# EAGLE design ESP32Driver (EAGLE 9.6.2)

## Sheet 1 of 4: ESP32
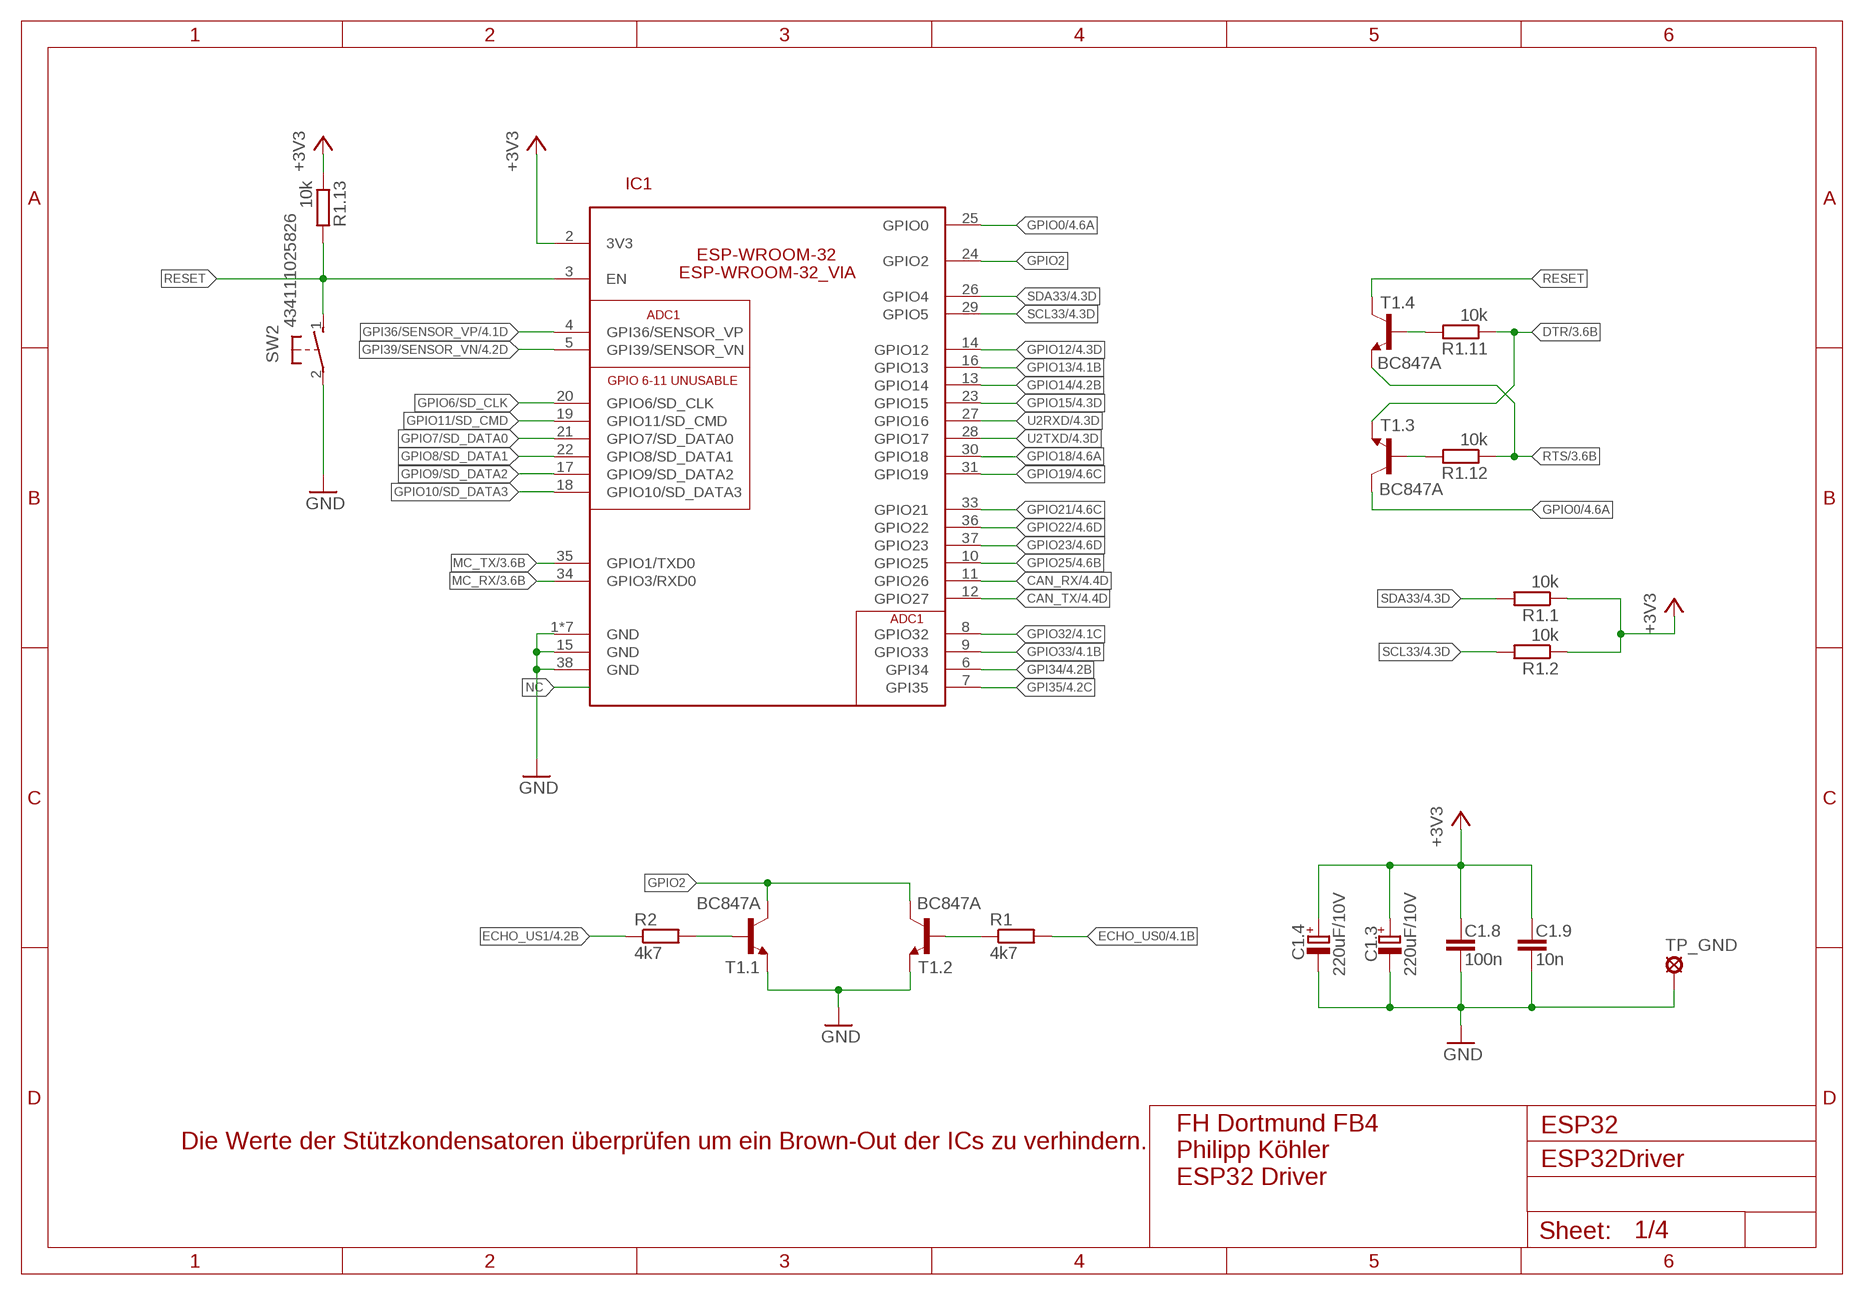
[diagram p0: schematic, sheet 1]

### Parts
C1.3  220uF/10V  CPOL-EUSMCC  [SMC_C]
C1.4  220uF/10V  CPOL-EUSMCC  [SMC_C]
C1.8  100n  C-EUC0805  [C0805]
C1.9  10n  C-EUC0805  [C0805]
IC1  ESP-WROOM-32_VIA  [ESP-WROOM-32-VIA]
R1  4k7  R-EU_R0603  [R0603]
R1.1  10k  R-EU_R0805  [R0805]
R1.2  10k  R-EU_R0805  [R0805]
R1.11  10k  R-EU_R0805  [R0805]
R1.12  10k  R-EU_R0805  [R0805]
R1.13  10k  R-EU_R0805  [R0805]
R2  4k7  R-EU_R0603  [R0603]
SW2  434111025826  [434121025816]
T1.1  BC847A  BC847ALT1SMD  [SOT23]
T1.2  BC847A  BC847ALT1SMD  [SOT23]
T1.3  BC847A  BC847ALT1SMD  [SOT23]
T1.4  BC847A  BC847ALT1SMD  [SOT23]
TP_GND  GND  LSP10  [LSP10]

### Nets
+3V3: C1.3.+ C1.4.+ C1.8.1 C1.9.1 IC1.2(3V3) R1.1.1 R1.2.1 R1.13.1 ; also sheet 2,3,4
CAN_RX: IC1.11(GPIO26) ; also sheet 4
CAN_TX: IC1.12(GPIO27) ; also sheet 4
DTR: R1.11.1 T1.3.2(E) ; also sheet 3
ECHO_US0: R1.2 ; also sheet 4
ECHO_US1: R2.1 ; also sheet 4
GND: C1.3.- C1.4.- C1.8.2 C1.9.2 IC1.1(GND) IC1.15(GND) IC1.38(GND) IC1.T_VIA1(GND) IC1.T_VIA2(GND) IC1.T_VIA3(GND) IC1.T_VIA4(GND) IC1.THERMAL1(GND) IC1.THERMAL(GND) SW2.2 T1.1.2(E) T1.2.2(E) TP_GND.MP ; also sheet 2,3,4
GPI34: IC1.6(GPI34) ; also sheet 4
GPI35: IC1.7(GPI35) ; also sheet 4
GPI36/SENSOR_VP: IC1.4(GPI36/SENSOR_VP) ; also sheet 4
GPI39/SENSOR_VN: IC1.5(GPI39/SENSOR_VN) ; also sheet 4
GPIO0: IC1.25(GPIO0) T1.3.3(C) ; also sheet 4
GPIO2: IC1.24(GPIO2) T1.1.3(C) T1.2.3(C)
GPIO6/SD_CLK: IC1.20(GPIO6/SD_CLK)
GPIO7/SD_DATA0: IC1.21(GPIO7/SD_DATA0)
GPIO8/SD_DATA1: IC1.22(GPIO8/SD_DATA1)
GPIO9/SD_DATA2: IC1.17(GPIO9/SD_DATA2)
GPIO10/SD_DATA3: IC1.18(GPIO10/SD_DATA3)
GPIO11/SD_CMD: IC1.19(GPIO11/SD_CMD)
GPIO12: IC1.14(GPIO12) ; also sheet 4
GPIO13: IC1.16(GPIO13) ; also sheet 4
GPIO14: IC1.13(GPIO14) ; also sheet 4
GPIO15: IC1.23(GPIO15) ; also sheet 4
GPIO18: IC1.30(GPIO18) ; also sheet 4
GPIO19: IC1.31(GPIO19) ; also sheet 4
GPIO21: IC1.33(GPIO21) ; also sheet 4
GPIO22: IC1.36(GPIO22) ; also sheet 4
GPIO23: IC1.37(GPIO23) ; also sheet 4
GPIO25: IC1.10(GPIO25) ; also sheet 4
GPIO32: IC1.8(GPIO32) ; also sheet 4
GPIO33: IC1.9(GPIO33) ; also sheet 4
MC_RX: IC1.34(GPIO3/RXD0) ; also sheet 3
MC_TX: IC1.35(GPIO1/TXD0) ; also sheet 3
N$2: R1.1 T1.2.1(B)
N$3: R2.2 T1.1.1(B)
N$9: R1.12.2 T1.3.1(B)
N$10: R1.11.2 T1.4.1(B)
NC: IC1.32(NC)
RESET: IC1.3(EN) R1.13.2 SW2.1 T1.4.3(C)
RTS: R1.12.1 T1.4.2(E) ; also sheet 3
SCL33: IC1.29(GPIO5) R1.2.2 ; also sheet 4
SDA33: IC1.26(GPIO4) R1.1.2 ; also sheet 4
U2RXD: IC1.27(GPIO16) ; also sheet 4
U2TXD: IC1.28(GPIO17) ; also sheet 4

### Notes on the sheet
- ADC1
- GPIO 6-11 UNUSABLE
- ADC1
- ESP32
- Die Werte der Stützkondensatoren überprüfen um ein Brown-Out der ICs zu verhindern.
- FH Dortmund FB4
  Philipp Köhler
  ESP32 Driver

## Sheet 2 of 4: Spannungsversorgung
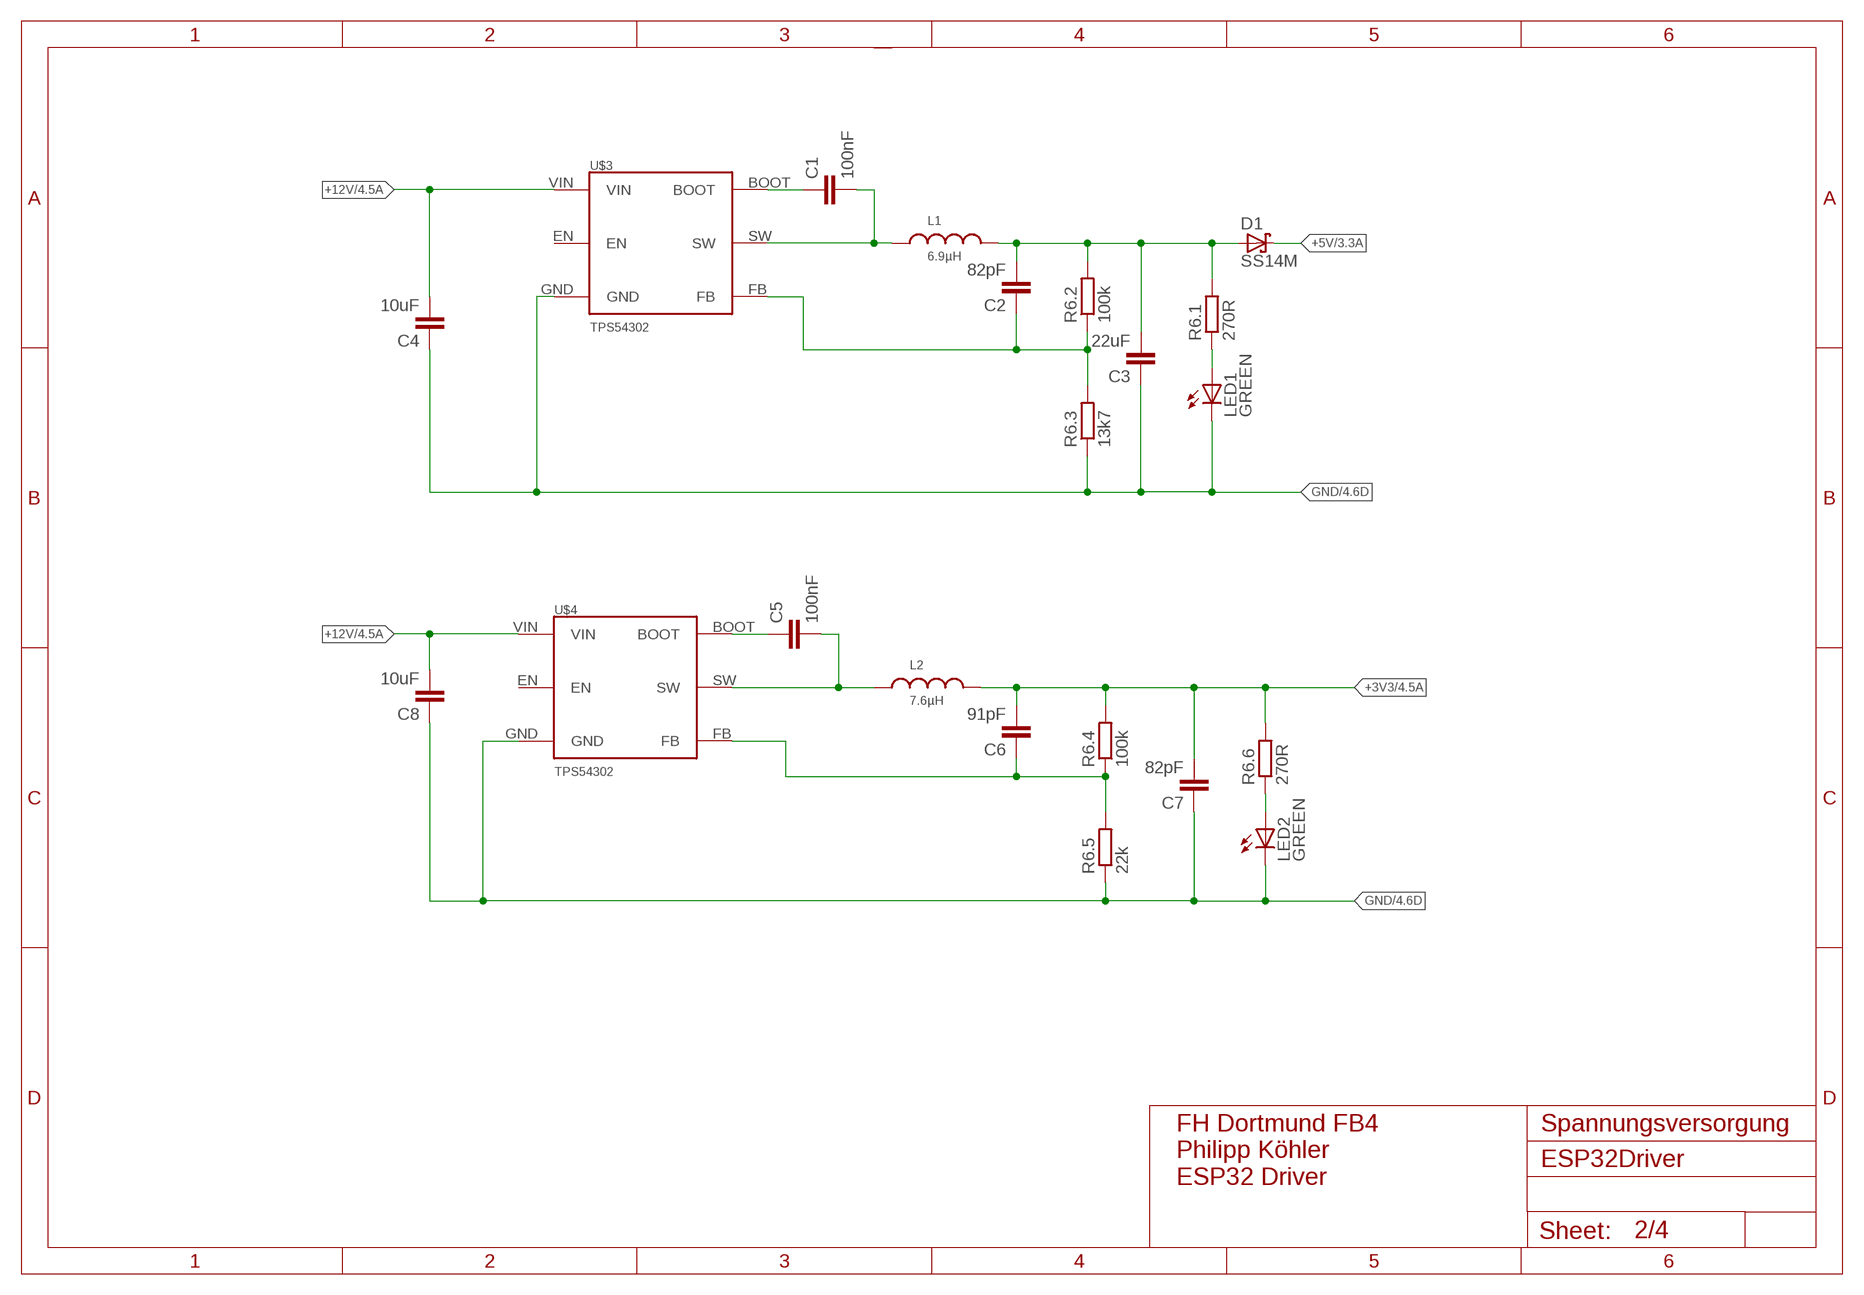
[diagram p1: schematic, sheet 2]

### Parts
C1  100nF  C-EUC0805  [C0805]
C2  82pF  C-EUC0805  [C0805]
C3  22uF  C-EUC0805  [C0805]
C4  10uF  C-EUC0805  [C0805]
C5  100nF  C-EUC0805  [C0805]
C6  91pF  C-EUC0805  [C0805]
C7  82pF  C-EUC0805  [C0805]
C8  10uF  C-EUC0805  [C0805]
D1  SS14M  [MICRO-SMA]
L1  6.9µH  WE-HCI_7050_744314650  [WE-HCI_7030/7040/7050]
L2  7.6µH  WE-HCI_7050_744314760  [WE-HCI_7030/7040/7050]
LED1  GREEN  LEDSML0805  [SML0805]
LED2  GREEN  LEDSML0805  [SML0805]
R6.1  270R  R-EU_R0805  [R0805]
R6.2  100k  R-EU_R0805  [R0805]
R6.3  13k7  R-EU_R0805  [R0805]
R6.4  100k  R-EU_R0805  [R0805]
R6.5  22k  R-EU_R0805  [R0805]
R6.6  270R  R-EU_R0805  [R0805]
U$3  TPS54302  [SOT95P280X110-6]
U$4  TPS54302  [SOT95P280X110-6]

### Nets
+3V3: C6.2 C7.2 L2.2 R6.4.2 R6.6.2 ; also sheet 1,3,4
+5V: D1.1(C) ; also sheet 3,4
+12V: C4.2 C8.2 U$3.VIN U$4.VIN ; also sheet 4
GND: C3.1 C4.1 C7.1 C8.1 LED1.C LED2.C R6.3.1 R6.5.1 U$3.GND U$4.GND ; also sheet 1,3,4
N$1: C2.2 C3.2 D1.2(A) L1.2 R6.1.2 R6.2.2
N$4: C1.1 U$3.BOOT
N$5: C1.2 L1.1 U$3.SW
N$7: C2.1 R6.2.1 R6.3.2 U$3.FB
N$8: C5.1 U$4.BOOT
N$11: LED1.A R6.1.1
N$14: C5.2 L2.1 U$4.SW
N$15: C6.1 R6.4.1 R6.5.2 U$4.FB
N$27: LED2.A R6.6.1
Unconnected: U$3.EN U$4.EN

### Notes on the sheet
- Spannungsversorgung
- FH Dortmund FB4
  Philipp Köhler
  ESP32 Driver

## Sheet 3 of 4: USB-Serial-Converter
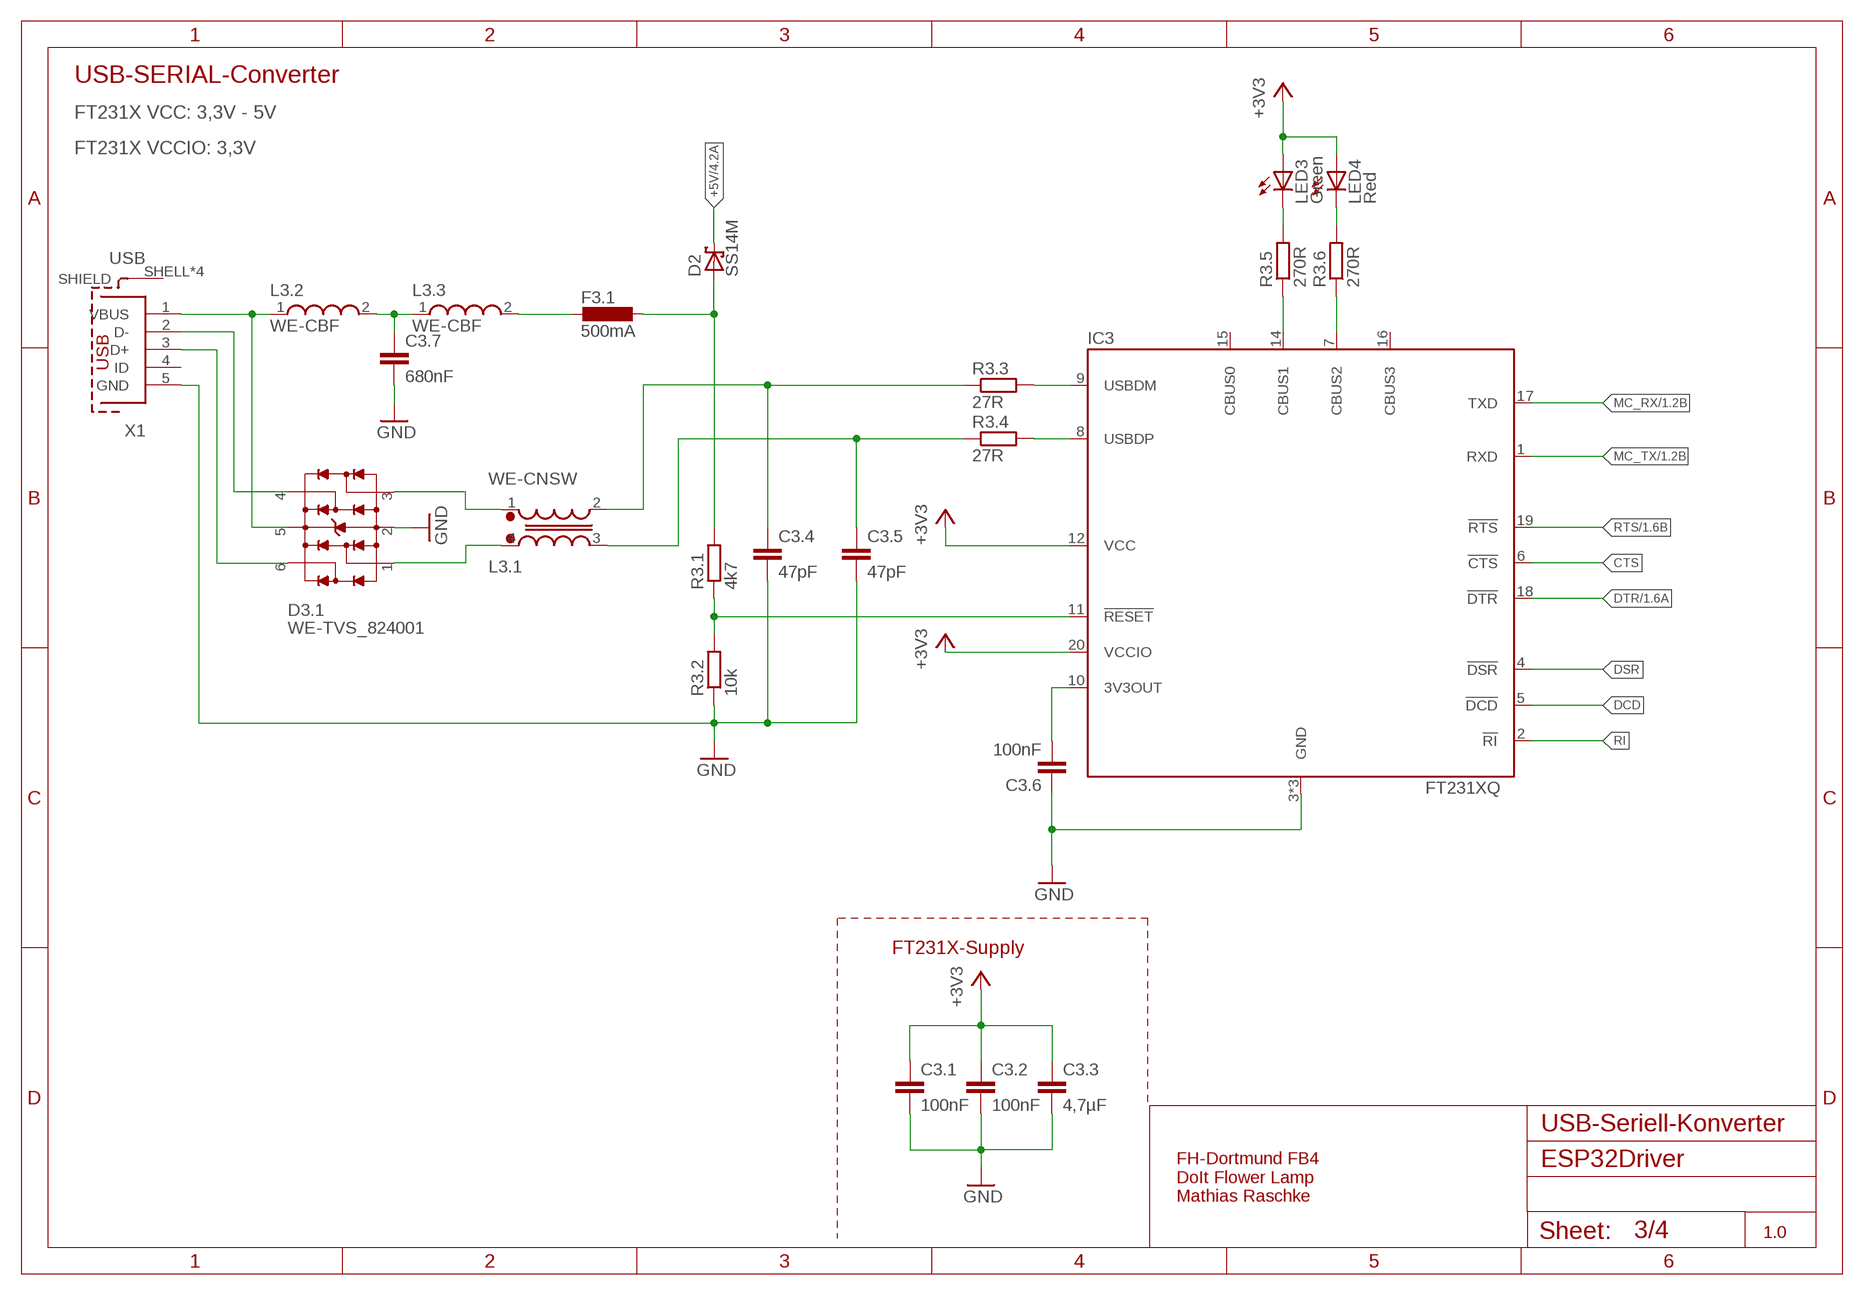
[diagram p2: schematic, sheet 3]

### Parts
C3.1  100nF  C-EUC0603  [C0603]
C3.2  100nF  C-EUC0603  [C0603]
C3.3  4,7µF  C-EUC0805  [C0805]
C3.4  47pF  C-EUC0603  [C0603]
C3.5  47pF  C-EUC0603  [C0603]
C3.6  100nF  C-EUC0603  [C0603]
C3.7  680nF  C-EUC0603  [C0603]
D2  SS14M  [MICRO-SMA]
D3.1  WE-TVS_824001  [WE-TVS_SOT23-6L]
F3.1  500mA  L-EUL1812  [L1812]
IC3  FT231XQ  [QFN20]
L3.1  WE-CNSW  WE-CNSW_1206  [WE-CNSW_1206]
L3.2  WE-CBF  WE-CBF_0603(WB/HS)  [WE-CBF_0603(W=2.2)]
L3.3  WE-CBF  WE-CBF_0603(WB/HS)  [WE-CBF_0603(W=2.2)]
LED3  Green  LEDCHIPLED_0805  [CHIPLED_0805]
LED4  Red  LEDCHIPLED_0805  [CHIPLED_0805]
R3.1  4k7  R-EU_R0603  [R0603]
R3.2  10k  R-EU_R0603  [R0603]
R3.3  27R  R-EU_R0603  [R0603]
R3.4  27R  R-EU_R0603  [R0603]
R3.5  270R  R-EU_R0805  [R0805]
R3.6  270R  R-EU_R0805  [R0805]
X1  USB  629105136821  [629105136821]

### Nets
3V3OUT: C3.6.2 IC3.10(3V3OUT)
+3V3: C3.1.1 C3.2.1 C3.3.1 IC3.12(VCC) IC3.20(VCCIO) LED3.A LED4.A ; also sheet 1,2,4
+5V: D2.1(C) ; also sheet 2,4
_N: D3.1.4 X1.2(D-)
_P: D3.1.6 X1.3(D+)
CTS: IC3.6(!CTS)
DCD: IC3.5(!DCD)
DSR: IC3.4(!DSR)
DTR: IC3.18(!DTR) ; also sheet 1
GND: C3.1.2 C3.2.2 C3.3.2 C3.4.2 C3.5.2 C3.6.1 C3.7.2 D3.1.2(GND) IC3.3(GND) IC3.13(GND) IC3.EXP(GND) R3.2.1 X1.5(GND) ; also sheet 1,2,4
MC_RX: IC3.17(TXD) ; also sheet 1
MC_TX: IC3.1(RXD) ; also sheet 1
N$12: IC3.14(CBUS1) R3.5.1
N$13: IC3.7(CBUS2) R3.6.1
N$16: LED3.C R3.5.2
N$17: LED4.C R3.6.2
N$18 [D_P]: IC3.8(USBDP) R3.4.2
N$19 [D_P]: IC3.9(USBDM) R3.3.2
N$20 [D_P]: C3.5.1 L3.1.3 R3.4.1
N$21 [D_N]: C3.4.1 L3.1.2 R3.3.1
N$22: IC3.11(!RESET) R3.1.1 R3.2.2
N$23 [D_N]: D3.1.1 L3.1.4
N$24 [D_P]: D3.1.3 L3.1.1
N$25: C3.7.1 L3.2.2 L3.3.1
N$26: D3.1.5(VDD) L3.2.1 X1.1(VBUS)
N$30: F3.1.2 L3.3.2
RI: IC3.2(!RI)
RTS: IC3.19(!RTS) ; also sheet 1
VUSB: D2.2(A) F3.1.1 R3.1.2
Unconnected: IC3.15(CBUS0) IC3.16(CBUS3) X1.4(ID) X1.SHELL1(SHIELD) X1.SHELL2(SHIELD) X1.SHELL3(SHIELD) X1.SHELL(SHIELD)

### Notes on the sheet
- USB-SERIAL-Converter
- FT231X VCC: 3,3V - 5V
- FT231X VCCIO: 3,3V
- FT231X-Supply
- USB-Seriell-Konverter
- FH-Dortmund FB4
  DoIt Flower Lamp
  Mathias Raschke
- 1.0

## Sheet 4 of 4: Pinout
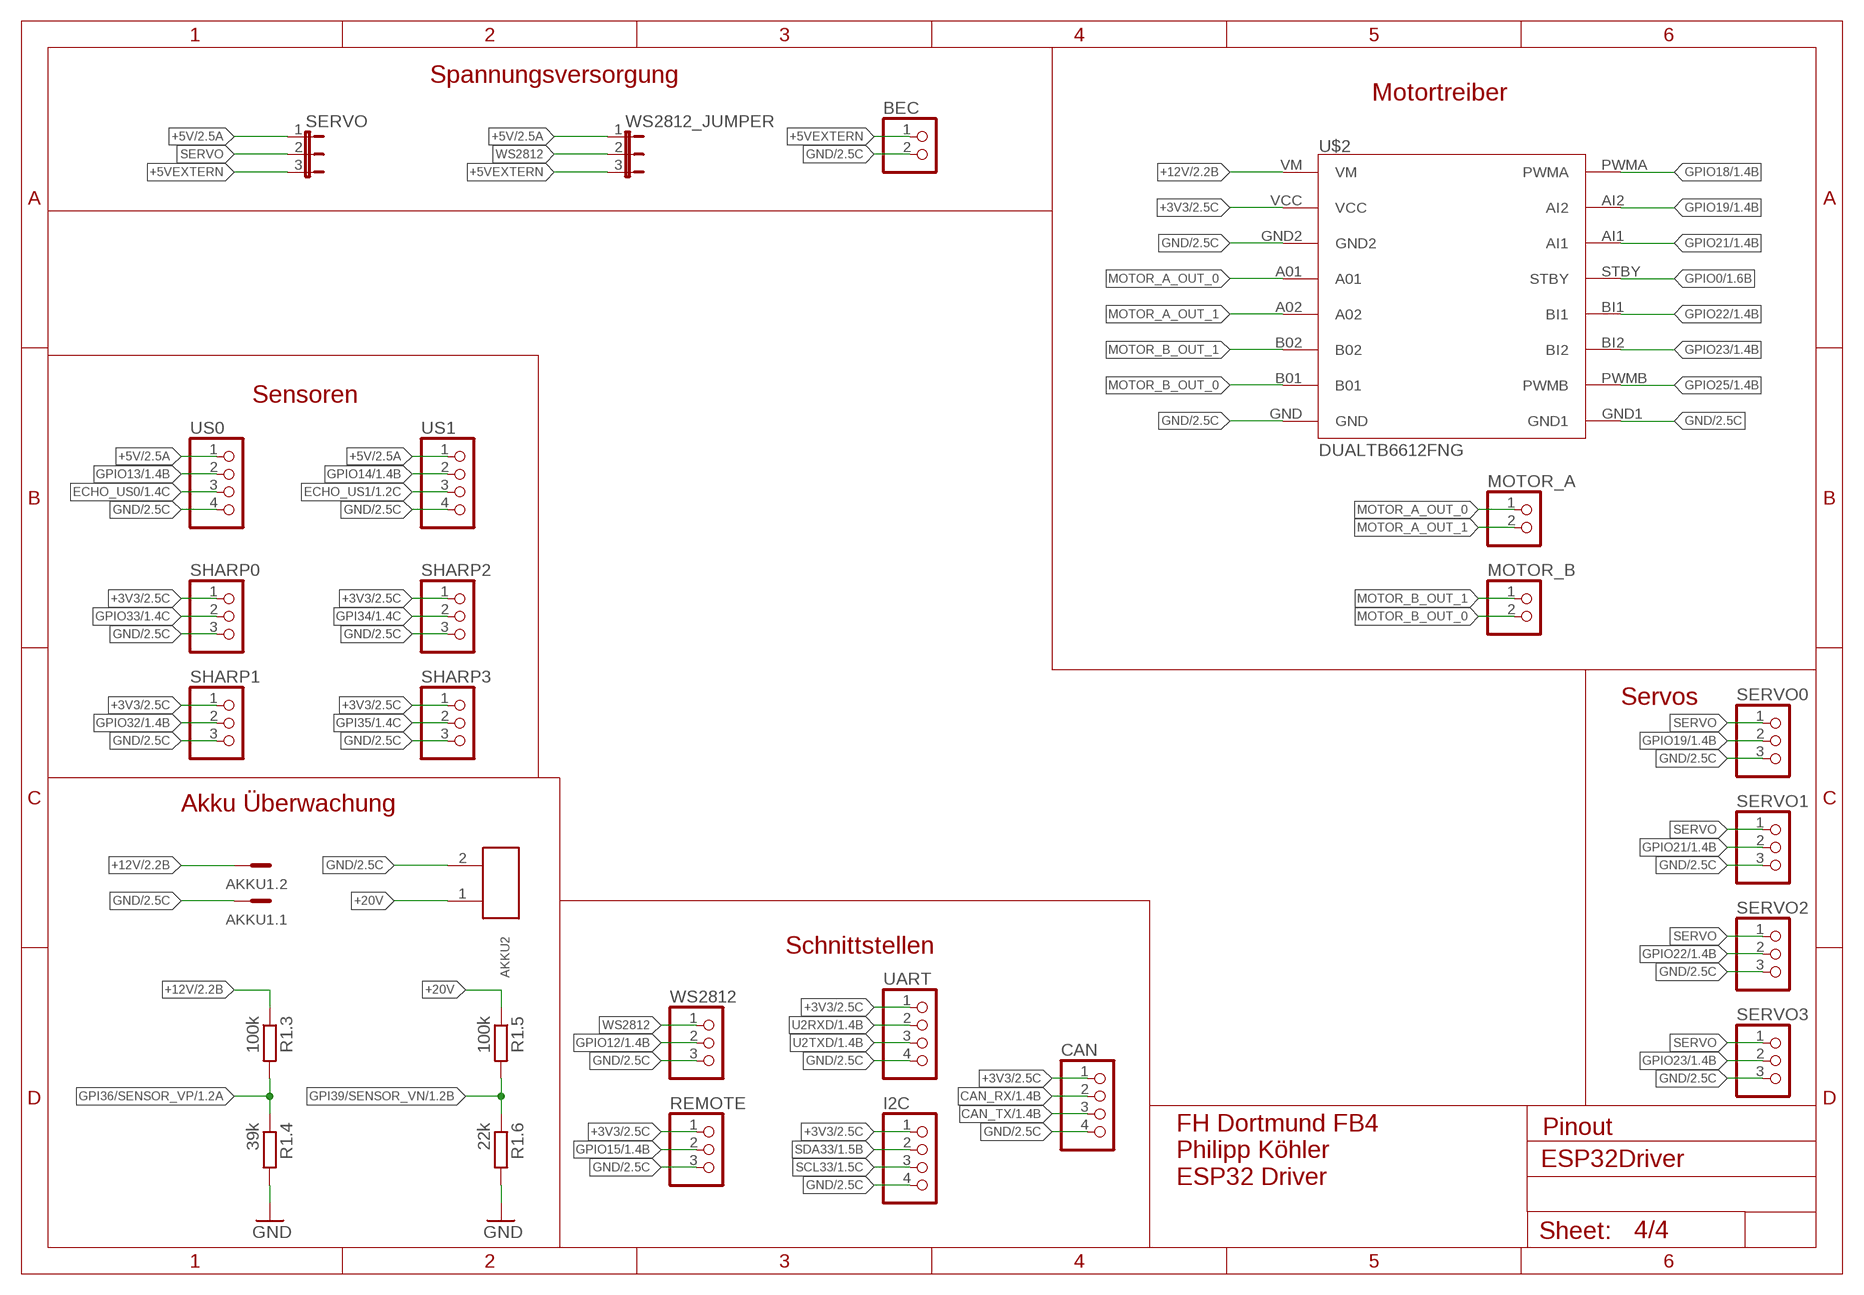
[diagram p3: schematic, sheet 4]

### Parts
AKKU1  RIA_382_02  [382_02]
AKKU2  620102131822  [620102131822]
BEC  PINHD-1X2  [1X02]
CAN  PINHD-1X4  [1X04]
I2C  PINHD-1X4  [1X04]
MOTOR_A  PINHD-1X2  [1X02]
MOTOR_B  PINHD-1X2  [1X02]
R1.3  100k  R-EU_R0805  [R0805]
R1.4  39k  R-EU_R0805  [R0805]
R1.5  100k  R-EU_R0805  [R0805]
R1.6  22k  R-EU_R0805  [R0805]
REMOTE  PINHD-1X3  [1X03]
SERVO  JP2E  [JP2]
SERVO0  PINHD-1X3  [1X03]
SERVO1  PINHD-1X3  [1X03]
SERVO2  PINHD-1X3  [1X03]
SERVO3  PINHD-1X3  [1X03]
SHARP0  PINHD-1X3  [1X03]
SHARP1  PINHD-1X3  [1X03]
SHARP2  PINHD-1X3  [1X03]
SHARP3  PINHD-1X3  [1X03]
U$2  DUALTB6612FNG  [DUALTB6612FNG]
UART  PINHD-1X4  [1X04]
US0  PINHD-1X4  [1X04]
US1  PINHD-1X4  [1X04]
WS2812  PINHD-1X3  [1X03]
WS2812_JUMPER  JP2E  [JP2]

### Nets
+3V3: CAN.1 I2C.1 REMOTE.1 SHARP0.1 SHARP1.1 SHARP2.1 SHARP3.1 U$2.VCC UART.1 ; also sheet 1,2,3
+5V: SERVO.1 US0.1 US1.1 WS2812_JUMPER.1 ; also sheet 2,3
+5VEXTERN: BEC.1 SERVO.3 WS2812_JUMPER.3
+12V: AKKU1.2 R1.3.1 U$2.VM ; also sheet 2
+20V: AKKU2.1 R1.5.1
CAN_RX: CAN.2 ; also sheet 1
CAN_TX: CAN.3 ; also sheet 1
ECHO_US0: US0.3 ; also sheet 1
ECHO_US1: US1.3 ; also sheet 1
GND: AKKU1.1 AKKU2.2 BEC.2 CAN.4 I2C.4 R1.4.2 R1.6.2 REMOTE.3 SERVO0.3 SERVO1.3 SERVO2.3 SERVO3.3 SHARP0.3 SHARP1.3 SHARP2.3 SHARP3.3 U$2.GND U$2.GND1 U$2.GND2 UART.4 US0.4 US1.4 WS2812.3 ; also sheet 1,2,3
GPI34: SHARP2.2 ; also sheet 1
GPI35: SHARP3.2 ; also sheet 1
GPI36/SENSOR_VP: R1.3.2 R1.4.1 ; also sheet 1
GPI39/SENSOR_VN: R1.5.2 R1.6.1 ; also sheet 1
GPIO0: U$2.STBY ; also sheet 1
GPIO12: WS2812.2 ; also sheet 1
GPIO13: US0.2 ; also sheet 1
GPIO14: US1.2 ; also sheet 1
GPIO15: REMOTE.2 ; also sheet 1
GPIO18: U$2.PWMA ; also sheet 1
GPIO19: SERVO0.2 U$2.AI2 ; also sheet 1
GPIO21: SERVO1.2 U$2.AI1 ; also sheet 1
GPIO22: SERVO2.2 U$2.BI1 ; also sheet 1
GPIO23: SERVO3.2 U$2.BI2 ; also sheet 1
GPIO25: U$2.PWMB ; also sheet 1
GPIO32: SHARP1.2 ; also sheet 1
GPIO33: SHARP0.2 ; also sheet 1
MOTOR_A_OUT_0: MOTOR_A.1 U$2.A01
MOTOR_A_OUT_1: MOTOR_A.2 U$2.A02
MOTOR_B_OUT_0: MOTOR_B.2 U$2.B01
MOTOR_B_OUT_1: MOTOR_B.1 U$2.B02
SCL33: I2C.3 ; also sheet 1
SDA33: I2C.2 ; also sheet 1
SERVO: SERVO0.1 SERVO1.1 SERVO2.1 SERVO3.1 SERVO.2
U2RXD: UART.2 ; also sheet 1
U2TXD: UART.3 ; also sheet 1
WS2812: WS2812.1 WS2812_JUMPER.2

### Notes on the sheet
- Spannungsversorgung
- Motortreiber
- Sensoren
- Servos
- Akku Überwachung
- Schnittstellen
- Pinout
- FH Dortmund FB4
  Philipp Köhler
  ESP32 Driver

## Library data of the parts
AKKU1 = HW1_connectors:RIA_382: RIA Typ 382 Wannenstecker, gewinkelt Anschlussklemmen-Stecksystem Gerader Wannenstecker für AKL 369-xx. Rastermaß: 3,81 mm Lötstift und Steckerstift: 0,8x0,8 mm Autor: Mathias Raschke; REICHELT: AKL 382-02
AKKU2 = Wire-to-Board (rev18a):620102131822: WR-WTB 2.00mm SMT Male Horizontal Shrouded Header, 2 Pins=>Code : Con_WTB_2.00_PCB_SMT_620102131822 <http://katalog.we-online.de/media/thumbs2/eican/thb_Con_WTB_2.00_PCB_SMT_6201xx131822_pf2.jpg> Details see: http://katalog.we-online.de/en/em/WTB_2_00_SMT_MALE_HORIZONTAL_SHROUDED_HEADER_6201XX131822 Created 2014-06-05, Karrer Zheng 2014 (C) Würth Elektronik
BEC MOTOR_A MOTOR_B = pinhead:PINHD-1X2: PIN HEADER
C1 C1.8 C1.9 C2 C3 C3.1-C3.7 C4-C8 = rcl:C-EU: CAPACITOR, European symbol; SPICEPREFIX: C
C1.3 C1.4 = rcl:CPOL-EU: POLARIZED CAPACITOR, European symbol
CAN I2C UART US0 US1 = pinhead:PINHD-1X4: PIN HEADER
D1 D2 = Dioden:SS14: SS14 1A, 40V Surface Mount Schottky Barrier Rectifier SS14M Package: Micro SMA Periodische Sperrspannung Vrrm, max.: 40V Durchlassstrom (mittlerer) If(AV): 1A Diodenkonfiguration: Einfach Bauform - Diode: MicroSMA Anzahl der Pins: 2Pins Durchlassspannung Vf max.: 550mV Spitzendurchlassstrom Ifsm, max.: 25A Betriebstemperatur, max.: 150°C Mathias Raschke; FARNELL: 1863139
D3.1 = Wurth_Elektronik_Passive_rev15d:WE-TVS_824001: TVS Diode High Speed Series Characteristics Low clamping voltage Sturdy design Very low capacitance Flow Thru Design for a simple layout Rail to Rail protection Epoxy flame resistant UL94 V-0 RoHS, REACH and free of halogens Applications Very fast data lines USB 2.0 Ethernet PoE VGA Sim Cards Keypads ESD protection in accordance with EN 61000-4-2, – 8 kV contact discharge – 15 kV air discharge <http://katalog.we-online.de/media/images/eisos/VarTVS_highspeed_pf2.jpg.jpg> Details see: http://katalog.we-online.de/en/pbs/WE-TVS_High_Speed/824001? Updated by Dan Xu 2014-07-11 2014 (C) Wurth Elektronik
F3.1 = rcl:L-EU: INDUCTOR, European symbol; SPICEPREFIX: L
IC1 = HW1_poststamp_Modules:ESP-WROOM-32: ESP-WROOM-32 generic WiFi-BT-BLE MCU FCC/CE/IC/TELEC/KCC/SRRC/NCC Certified Bluetooth v4.2 BR/EDR and BLE specification Projekt: GeoMobile BusCore2 Autor: Matthias Farke Quelle: Espressif <https://www.espressif.com/en>
IC3 = FT231X_conflict-20180105-162839:FT231X: FT231X The FT231X is a USB to serial UART interface. Data transfer rates from 300 baud to 3 Mbaud (RS422, RS485, and RS232 ) at TTL levels. Part Numbers FT231XQ / 20 Pin QFN FT231XS / 20 Pin SSOP Mathias Raschke
L1 = PowerMagnetics (rev18e):WE-HCI_7050: SMD Flat Wire High Current Inductor Characteristics Magnetically shielded Flat wire coil for low losses at high frequency Low stray field Operating temperature: –40 °C to +150/155 °C Applications Graphic cards Laptops Industrial computers Motherboards High current switching regulators DC/DC converter Polyphase-switching regulators Filter <http://katalog.we-online.de/media/images/v2/Family_WE-HCI.jpg> Details see: http://katalog.we-online.de/en/pbs/WE-HCI? Updated by Dan Xu 2014-07-07 2014 (C) Wurth Elektronik; WE-NUMBER: 744314650/6,5uH
L2 = EMCComponents (rev18c):WE-HCI_7050: SMD Flat Wire High Current Inductor Characteristics Magnetically shielded Flat wire coil for low losses at high frequency Low stray field Operating temperature: –40 °C to +150/155 °C Applications Graphic cards Laptops Industrial computers Motherboards High current switching regulators DC/DC converter Polyphase-switching regulators Filter <http://katalog.we-online.de/media/images/v2/Family_WE-HCI.jpg> Details see: http://katalog.we-online.de/en/pbs/WE-HCI? Updated by Dan Xu 2014-07-07 2014 (C) Wurth Elektronik; WE-NUMBER: 744314760/7,6uH
L3.1 = Wurth_Elektronik_Passive_rev15d:WE-CNSW: WE-CNSW SMD Common Mode Line Filter Characteristics High common mode noise suppression at high frequencies Small influence on high speed signals through winding symmetry Operating temperature: –40 ºC to +125 ºC (Size 0805/1206/1812); –40 ºC to +105 ºC (Size 0603) Applications USB 2.0 IEEE 1394 (Firewire) LVDS High Speed Data Lines LAN <http://katalog.we-online.de/media/images/eisos/IndCNSW_pf2.jpg> Details see: http://katalog.we-online.de/en/pbs/WE-CNSW Updated by Dan Xu 2014-06-30 2014 (C) Wurth Elektronik
L3.2 L3.3 = Wurth_Elektronik_Passive_rev15d:WE-CBF: WE-CBF SMD EMI Suppression Ferrite Bead Characteristics Reliable Ni-Sn electrodes High rated current up to 6 A Operating temperature: –55 ºC to +125 ºC Applications Perfect as data lined filter and for uncoupling of distribution voltage Variant abbreviation WB means WIDE BAND HS means HIGH SPEED HC means HIGH CURRENT <http://katalog.we-online.de/media/images/eisos/FeCBF_pf2.jpg> Details see: http://katalog.we-online.de/en/pbs/WE-CBF Updated on 2014-06-19 2014 (C) Wurth Elektronik
LED1-LED4 = led:LED: LED OSRAM: - CHIPLED LG R971, LG N971, LY N971, LG Q971, LY Q971, LO R971, LY R971 LH N974, LH R974 LS Q976, LO Q976, LY Q976 LO Q996 - Hyper CHIPLED LW Q18S LB Q993, LB Q99A, LB R99A - SideLED LS A670, LO A670, LY A670, LG A670, LP A670 LB A673, LV A673, LT A673, LW A673 LH A674 LY A675 LS A676, LA A676, LO A676, LY A676, LW A676 LS A679, LY A679, LG A679 - Hyper Micro SIDELED® LS Y876, LA Y876, LO Y876, LY Y876 LT Y87S - SmartLED LW L88C, LW L88S LB L89C, LB L89S, LG L890 LS L89K, LO L89K, LY L89K LS L896, LA L896, LO L896, LY L896 - TOPLED LS T670, LO T670, LY T670, LG T670, LP T670 LSG T670, LSP T670, LSY T670, LOP T670, LYG T670 LG T671, LOG T671, LSG T671 LB T673, LV T673, LT T673, LW T673 LH T674 LS T676, LA T676, LO T676, LY T676, LB T676, LH T676, LSB T676, LW T676 LB T67C, LV T67C, LT T67C, LS T67K, LO T67K, LY T67K, LW E67C LS E67B, LA E67B, LO E67B, LY E67B, LB E67C, LV E67C, LT E67C LW T67C LS T679, LY T679, LG T679 LS T770, LO T770, LY T770, LG T770, LP T770 LB T773, LV T773, LT T773, LW T773 LH T774 LS E675, LA E675, LY E675, LS T675 LS T776, LA T776, LO T776, LY T776, LB T776 LHGB T686 LT T68C, LB T68C - Hyper Mini TOPLED® LB M676 - Mini TOPLED Santana® LG M470 LS M47K, LO M47K, LY M47K Source: http://www.osram.convergy.de LUXEON: - LUMILED® LXK2-PW12-R00, LXK2-PW12-S00, LXK2-PW14-U00, LXK2-PW14-V00 LXK2-PM12-R00, LXK2-PM12-S00, LXK2-PM14-U00 LXK2-PE12-Q00, LXK2-PE12-R00, LXK2-PE12-S00, LXK2-PE14-T00, LXK2-PE14-U00 LXK2-PB12-K00, LXK2-PB12-L00, LXK2-PB12-M00, LXK2-PB14-N00, LXK2-PB14-P00, LXK2-PB14-Q00 LXK2-PR12-L00, LXK2-PR12-M00, LXK2-PR14-Q00, LXK2-PR14-R00 LXK2-PD12-Q00, LXK2-PD12-R00, LXK2-PD12-S00 LXK2-PH12-R00, LXK2-PH12-S00 LXK2-PL12-P00, LXK2-PL12-Q00, LXK2-PL12-R00 Source: www.luxeon.com KINGBRIGHT: KA-3528ASYC Source: www.kingbright.com
R1 R2 = rcl:R-EU_: RESISTOR, European symbol; SPICEPREFIX: R
R1.1-R1.6 R1.11-R1.13 R3.1-R3.6 R6.1-R6.6 = rcl:R-EU_: RESISTOR, European symbol
REMOTE SERVO0 SERVO1-SERVO3 SHARP0 SHARP1-SHARP3 WS2812 = pinhead:PINHD-1X3: PIN HEADER
SERVO WS2812_JUMPER = jumper:JP2E: JUMPER
SW2 = HW1_switches:434111025826: WURTH ELEKTRONIK 434111025826 Taster, 12 V, 50 mA, 260 N The 434111025826 is a 6 x 3.8mm surface mount Tactile Switch with 260 ±70g operation force. It comes with an UL94V-0 rated LCP housing and stem. Silver-plated stainless steel contact and terminal. 6 x 3.8mm 2.5mm Height created by Mathias Raschke; FARNELL: 1867992
T1.1-T1.4 = transistor-npn:BC847*: NPN Transistor
TP_GND = solpad:LSP10: SOLDER PAD drill 1.0 mm, distributor Buerklin, 12H555
U$2 = Sparkfun_Motortreiber:DUALTB6612FNG: SparkFun Motor Driver - Dual TB6612FNG (1A) The TB6612FNG Motor Driver can control up to two DC motors at a constant current of 1.2A (3.2A peak). Two input signals (IN1 and IN2) can be used to control the motor in one of four function modes: CW, CCW, short-brake and stop. The two motor outputs (A and B) can be separately controlled, and the speed of each motor is controlled via a PWM input signal with a frequency up to 100kHz. The STBY pin should be pulled high to take the motor out of standby mode. Logic supply voltage (VCC) can be in the range of 2.7--5.5VDC, while the motor supply (VM) is limited to a maximum voltage of 15VDC. The output current is rated up to 1.2A per channel (or up to 3.2A for a short, single pulse).
U$3 U$4 = TPS54302:TPS54302: TPS54302 4.5-V to 28-V Input, 3-A Output, EMI Friendly Synchronous Step-Down Converter Features 4.5-V to 28-V Wide Input Voltage Range Integrated 85-mΩ and 40-mΩ MOSFETs for 3-A,Continuous Output Current Low 2-μA Shutdown, 45-μA Quiescent Current Internal 5-mS Soft-Start Fixed 400-kHz Switching Frequency Frequency Spread Spectrum to Reduce EMI Advanced Eco-mode™ Pulse Skip Peak Current Mode Control Internal Loop Compensation Overcurrent Protection for Both MOSFETs with Hiccup Mode Protection Over Voltage Protection Thermal Shutdown SOT-23 (6) Package Description The TPS54302 is a 4.5-V to 28-V input voltage range, 3-A synchronous buck converter. The device includes two integrated switching FETs, internal loop compensation and 5-ms internal soft start to reduce component count. By integrating the MOSFETs and employing the SOT23 package, the TPS54302 achieves the high power density and offers a small footprint on the PCB. Advanced Eco-mode implementation maximizes the light load efficiency and reduces the power loss. In the TPS54302, the frequency spread spectrum operation is introduced for EMI reduction. Cycle-by-cycle current limit in both high-side MOSFET protects the converter in an overload condition and is enhanced by a low-side MOSFET freewheeling current limit which prevents current runaway. Hiccup mode protection is triggered if the overcurrent condition has persisted for longer than the present time. Applications • 12-V, 24-V Distributed Power-Bus Supply • Industry Application – White Goods • Consumer Application – Audio – STB, DTV – Printer
X1 = EAGLE-INPUT_OUTPUT_CONNECTORS-rev17a:629105136821: WR-COM SMT Horizontal 5 Contacts Micro USB Type B,5 pins=>Code : Con_I-O_COM_MicroUSB_629105136821 <http://katalog.we-online.de/media/images/eican/Con_I-O_COM_MicroUSB_629105136821_pf2.jpg> Details see: http://katalog.we-online.de/en/em/COM_MICRO_SMT_TYPE_B_HORIZONTAL/629105136821?m Created 2014-07-09, Karrer Zheng 2014 (C) Würth Elektronik

## Board
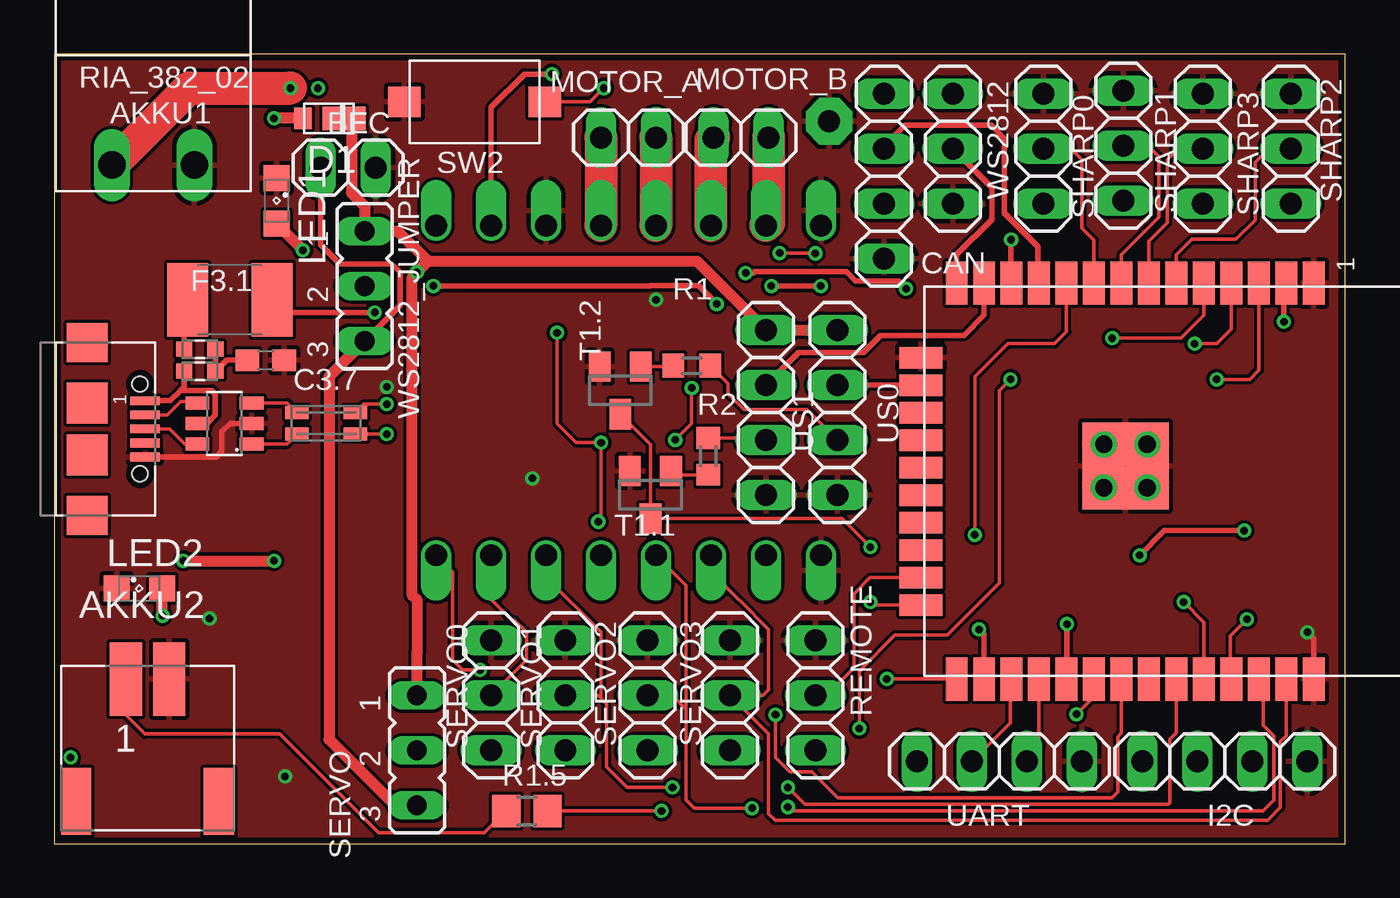
[diagram p4: board, top side]
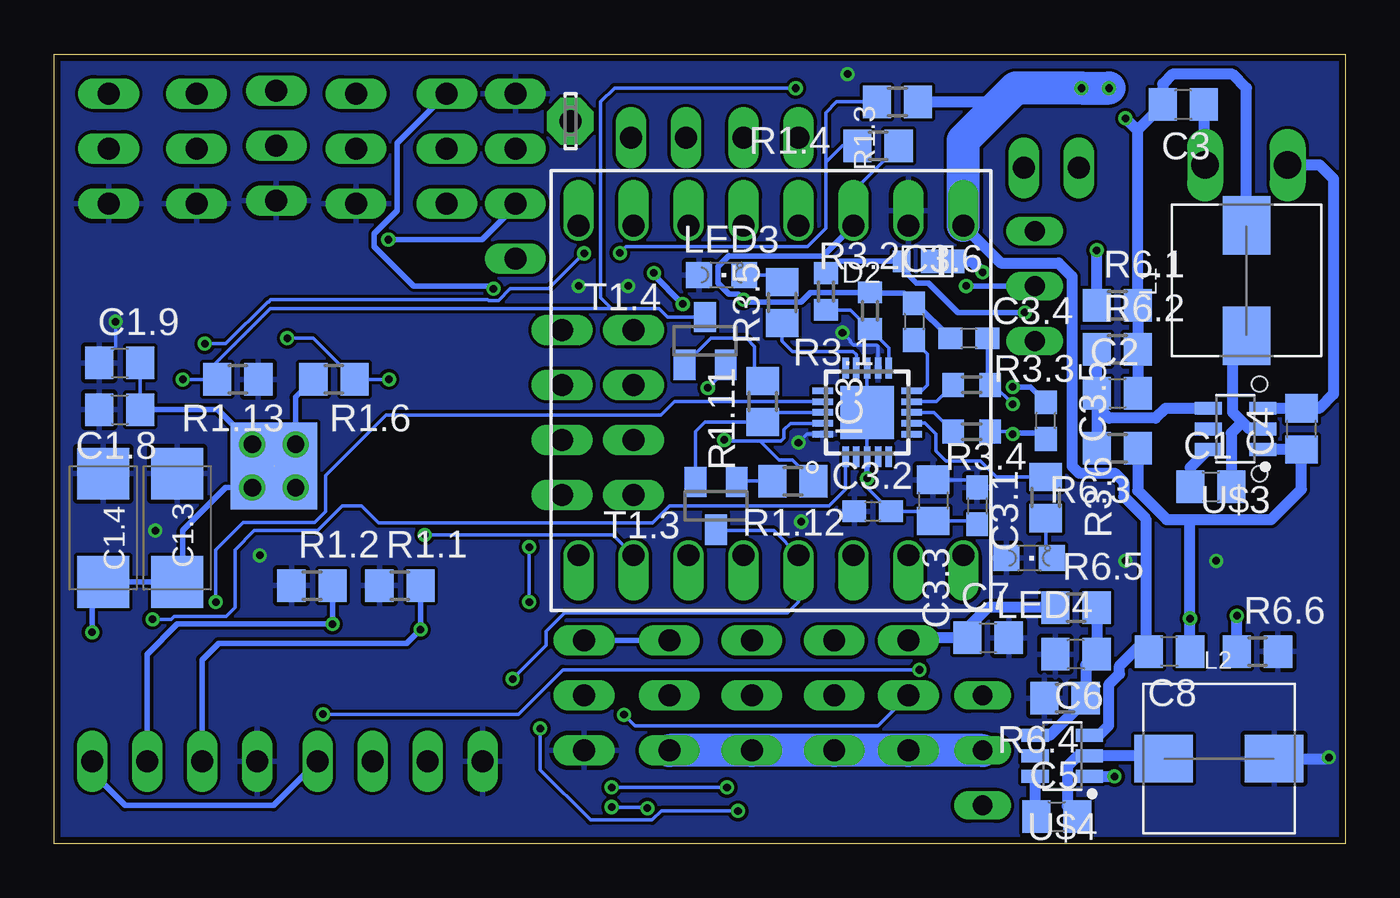
[diagram p5: board, bottom side, seen from below]

Size 59.67 x 36.5 mm. Coordinates in mm from the lower left corner, seen from the top.
Outline: 0,0 59.67,0 59.67,36.5 0,36.5 0,0
Copper layers (1*16): Top 0.035mm / dielectric 1.5mm / Bottom 0.035mm
Design rules "PCB-POOL Standard *": minimum track width 0.15mm, minimum drill 0.3mm, track to track 0.15mm, track to pad 0.15mm, pad to pad 0.15mm, via to via 0.15mm, smd to smd 0.15mm, copper to edge 0.3mm, drill to drill 0.2mm, minimum pad ring 0.2mm, minimum via ring 0.15mm, stop-mask expansion 0.075mm, vias tented up to drill 0mil, thermal gap 0.2mm

### Footprints (pad centres in the part's own frame; a part is rotated, then mirrored left to right if it is on the bottom)
382_02 = drill 1.27 long: 1 -1.905,2.54; 2 1.905,2.54
620102131822 = smd 1.5 x 3.4: 1 -1,0; 2 1,0 | smd 1.4 x 3.1: Z1 -3.3,-5.65; Z2 3.3,-5.65
1X02 = drill 1.016 long: 1 -1.27,0; 2 1.27,0
C0805 = smd 1.3 x 1.5: 1 -0.95,0; 2 0.95,0
SMC_C = smd 2.4 x 2.4: + -2.5,0; - 2.5,0
C0603 = smd 1.1 x 1: 1 -0.85,0; 2 0.85,0
1X04 = drill 1.016 long: 1 -3.81,0; 2 -1.27,0; 3 1.27,0; 4 3.81,0
MICRO-SMA = smd 2 x 1.1: 1 -0.7,0 | smd 0.8 x 1: 2 1.2,0
WE-TVS_SOT23-6L = smd 0.6 x 1.1: 1 -0.95,-1.25; 2 0,-1.25; 3 0.95,-1.25; 4 0.95,1.25; 5 0,1.25; 6 -0.95,1.25
L1812 = smd 1.9 x 3.4: 1 -1.95,0; 2 1.95,0
ESP-WROOM-32-VIA = smd 2 x 1: 1 -9.15,5.25; 2 -9.15,3.98; 3 -9.15,2.71; 4 -9.15,1.44; 5 -9.15,0.17; 6 -9.15,-1.1; 7 -9.15,-2.37; 8 -9.15,-3.64; 9 -9.15,-4.91; 10 -9.15,-6.18; 11 -9.15,-7.45; 12 -9.15,-8.72; 13 -9.15,-9.99; 14 -9.15,-11.26; 25 9.15,-11.26; 26 9.15,-9.99; 27 9.15,-8.72; 28 9.15,-7.45; 29 9.15,-6.18; 30 9.15,-4.91; 31 9.15,-3.64; 32 9.15,-2.37; 33 9.15,-1.1; 34 9.15,0.17; 35 9.15,1.44; 36 9.15,2.71; 37 9.15,3.98; 38 9.15,5.25 | smd 1 x 2: 15 -5.7,-12.9; 16 -4.43,-12.9; 17 -3.16,-12.9; 18 -1.89,-12.9; 19 -0.62,-12.9; 20 0.65,-12.9; 21 1.92,-12.9; 22 3.19,-12.9; 23 4.46,-12.9; 24 5.73,-12.9 | drill 0.8: T_VIA1 -1.7,-2.45; T_VIA2 0.3,-2.45; T_VIA3 -1.7,-4.45; T_VIA4 0.3,-4.45 | smd 4 x 4: THERMAL -0.7,-3.45 | smd 4 x 4 bottom: THERMAL1 -0.7,-3.45
QFN20 = smd 0.95 x 0.3: 1 -2.05,1; 2 -2.05,0.5; 3 -2.05,0; 4 -2.05,-0.5; 5 -2.05,-1; 11 2.05,-1; 12 2.05,-0.5; 13 2.05,0; 14 2.05,0.5; 15 2.05,1 | smd 0.3 x 0.95: 6 -1,-2.05; 7 -0.5,-2.05; 8 0,-2.05; 9 0.5,-2.05; 10 1,-2.05; 16 1,2.05; 17 0.5,2.05; 18 0,2.05; 19 -0.5,2.05; 20 -1,2.05 | smd 2.45 x 2.45: EXP 0,0
WE-HCI_7030/7040/7050 = smd 2.7 x 2.2: 1 -2.55,0; 2 2.55,0
WE-CNSW_1206 = smd 1.1 x 0.6: 1 1.35,-0.5; 2 -1.35,-0.5; 3 -1.35,0.5; 4 1.35,0.5
WE-CBF_0603(W=2.2) = smd 0.75 x 0.7: 1 -0.725,0; 2 0.725,0
SML0805 = smd 1.2 x 1.2: A 1.05,0; C -1.05,0
CHIPLED_0805 = smd 1.2 x 1.2: A 0,-1.05; C 0,1.05
R0603 = smd 1 x 1.1: 1 -0.85,0; 2 0.85,0
R0805 = smd 1.3 x 1.5: 1 -0.95,0; 2 0.95,0
1X03 = drill 1.016 long: 1 -2.54,0; 2 0,0; 3 2.54,0
JP2 = drill 0.914 long: 1 -2.54,0; 2 0,0; 3 2.54,0
434121025816 = smd 1.5 x 1.4: 1 -3.25,0; 2 3.25,0
SOT23 = smd 1 x 1.4: 1 -0.95,-1.1; 2 0.95,-1.1; 3 0,1.1
LSP10 = drill 1.016 pad 2.159 octagon: MP 0,0
DUALTB6612FNG = drill 1 offset: A01 -7.62,1.27; A02 -7.62,-1.27; AI1 7.62,3.81; AI2 7.62,6.35; B01 -7.62,-6.35; B02 -7.62,-3.81; BI1 7.62,-1.27; BI2 7.62,-3.81; GND -7.62,-8.89; GND1 7.62,-8.89; GND2 -7.62,3.81; PWMA 7.62,8.89; PWMB 7.62,-6.35; STBY 7.62,1.27; VCC -7.62,6.35; VM -7.62,8.89
SOT95P280X110-6 = smd 1.25 x 0.589: BOOT 1.256,0.95; EN 1.256,0; FB 1.256,-0.95; GND -1.256,0.95; SW -1.256,0; VIN -1.256,-0.95
629105136821 = smd 0.4 x 1.35: 1 -1.3,2.675; 2 -0.65,2.675; 3 0,2.675; 4 0.65,2.675; 5 1.3,2.675 | smd 1.8 x 1.9: SHELL -4,0; SHELL3 4,0 | smd 1.9 x 1.9: SHELL1 -1.2,0; SHELL2 1.2,0 | hole 0.7: -2.075,2.45; 2.075,2.45

### Placement (x,y rotation side)
AKKU1  4.57,33.91 180 top
AKKU2  4.32,7.62 0 top
BEC  13.59,31.24 0 top
C1  6.22,16.51 0 bottom
C1.3  53.98,14.61 270 bottom
C1.4  57.4,14.61 270 bottom
C1.8  56.64,20.07 0 bottom
C1.9  56.64,22.23 0 bottom
C2  10.54,20.83 0 bottom
C3  7.49,34.16 180 bottom
C3.1  17.02,15.62 270 bottom
C3.2  21.84,15.37 0 bottom
C3.3  19.05,15.88 270 bottom
C3.4  17.4,23.37 180 bottom
C3.5  13.84,19.56 90 bottom
C3.6  19.94,24.13 270 bottom
C3.7  9.78,22.35 0 top
C4  2.03,19.18 90 bottom
C5  13.34,1.27 0 bottom
C6  12.45,8.76 180 bottom
C7  16.51,9.53 0 bottom
C8  8.13,8.89 180 bottom
CAN  38.35,30.86 270 top
D1  12.7,33.53 180 top
D2  19.3,26.92 180 bottom
D3.1  7.87,19.43 90 top
F3.1  8.13,25.15 180 top
I2C  54.1,3.81 0 top
IC1  52.96,16.76 270 top
IC3  22.1,19.94 90 bottom
L1  4.57,26.04 90 bottom
L2  5.84,3.94 0 bottom
L3.1  12.57,19.43 180 top
L3.2  6.73,21.84 0 top
L3.3  6.73,22.86 180 top
LED1  10.29,29.72 270 top
LED2  3.94,11.81 0 top
LED3  28.83,26.29 270 bottom
LED4  14.61,13.21 270 bottom
MOTOR_A  26.54,32.64 0 top
MOTOR_B  31.75,32.64 0 top
R1  29.46,22.1 0 top
R1.1  43.69,11.94 0 bottom
R1.2  47.75,11.94 0 bottom
R1.3  20.7,34.29 180 bottom
R1.4  21.59,32.26 0 bottom
R1.5  21.84,1.52 0 top
R1.6  46.74,21.46 180 bottom
R1.11  26.92,20.45 90 bottom
R1.12  25.53,16.76 180 bottom
R1.13  51.18,21.46 180 bottom
R2  30.23,17.91 270 top
R3.1  24,25.53 90 bottom
R3.2  21.97,24.64 270 bottom
R3.3  17.27,21.21 180 bottom
R3.4  17.27,19.05 180 bottom
R3.5  26.04,25.02 90 bottom
R3.6  13.84,16 270 bottom
R6.1  10.54,24.89 0 bottom
R6.2  10.54,22.86 0 bottom
R6.3  10.54,18.29 180 bottom
R6.4  12.95,6.73 180 bottom
R6.5  12.45,10.92 0 bottom
R6.6  4.06,8.89 0 bottom
REMOTE  35.18,6.86 90 top
SERVO  16.76,4.32 270 top
SERVO0  20.19,6.86 90 top
SERVO1  23.62,6.86 90 top
SERVO2  27.43,6.86 90 top
SERVO3  31.24,6.86 90 top
SHARP0  45.72,32.13 90 top
SHARP1  49.4,32.26 90 top
SHARP2  57.15,32.13 90 top
SHARP3  53.09,32.13 90 top
SW2  19.43,34.29 180 top
T1.1  27.56,16.13 180 top
T1.2  26.16,20.95 180 top
T1.3  29.08,15.62 180 bottom
T1.4  29.59,23.24 0 bottom
TP_GND  35.81,33.4 90 bottom
U$2  26.54,20.95 270 bottom
U$3  5.08,19.18 180 bottom
U$4  13.08,4.06 180 bottom
UART  43.69,3.81 0 top
US0  36.2,19.94 270 top
US1  32.89,19.94 270 top
WS2812  41.53,32.13 270 top
WS2812_JUMPER  14.35,25.78 270 top
X1  1.52,19.18 270 top

### Tracks (layer width: path | path; a pad name or v marks a point on that pad's centre or on a via)
3V3OUT
  Bottom 0.152: IC3.10 19.56,20.94 19.3,21.19 19.3,22.64 C3.6.2
+3V3  (via drill 0.35)
  Top 0.152: v25.15,14.89 25.27,15.01 v25.27,18.54 24.13,18.54 23.24,19.43 v23.24,23.62
  Top 0.254: v56.83,24.13 56.83,25.8 IC1.2 | v50.16,13.34 51.31,14.48 v54.99,14.48 | v33.15,25.78 v35.43,25.78 | U$2.VCC 20.19,34.04 21.73,35.58 v23,35.58
  Top 0.508: v5.97,13.08 v10.16,13.08
  Bottom 0.152: IC3.12 21.6,23 21.66,23.06 22.74,23.06 22.88,23.19 22.88,23.26 v23.24,23.62 | IC3.20 24.88,18.94 v25.27,18.54 | C3.1.1 17.37,16.82 C3.3.1 | C1.9.1 56.83,22.99 v56.83,24.13
  Bottom 0.508: L2.2 0.82,3.94 v0.76,4
  pour Bottom: 0.13,0 0.13,36.83 59.82,36.83 59.82,0
+5V  (via drill 0.35)
  Top 0.508: 17.27,26.92 15.88,28.32 WS2812_JUMPER.1 14.35,29.47 13.75,30.07 13.75,33.18 D1.1 | 17.27,26.92 29.72,26.92 US1.1 US0.1 | SERVO.1 16.76,8.86 16.79,8.88 16.79,11.24 16.55,11.48 16.55,26.2 v16.76,26.42 17.27,26.92
  Bottom 0.508: D2.1 17.27,26.92 v16.76,26.42
+5VEXTERN
  Top 0.254: BEC.1 12.32,27.69 13.21,26.8 15.6,26.8 15.98,26.42 15.98,24.87 WS2812_JUMPER.3
  Top 0.508: SERVO.3 15.75,1.78 12.7,4.83 12.7,21.59 WS2812_JUMPER.3
+12V  (via drill 0.35)
  Top 1.524: AKKU1.2 6.22,34.92 v10.92,34.92
  Bottom 0.508: U$2.VM 15.92,26.84 13.25,26.84 12.63,26.22 12.63,17.46 12.31,17.13 10.66,17.13 10.25,16.73 10.25,16.05 9.23,15.03 9.23,9.04 | R1.3.1 15.88,34.29 15.62,34.54 | U$4.VIN 11.4,5.01 10.95,5.46 10.95,7.34 10.44,7.85 10.44,8.23 9.63,9.04 9.23,9.04 | AKKU1.2 1.19,31.37 0.55,30.73 0.55,20.78 1.21,20.13 C4.2 U$3.VIN | 9.23,9.04 C8.2
  Bottom 1.524: U$2.VM 17.65,32.51 15.62,34.54 15.24,34.92 v12.19,34.92 v10.92,34.92
+20V
  Top 0.152: R1.5.1 19.88,0.51 14.99,0.51 10.41,5.08 4.19,5.08 3.32,5.95 AKKU2.1
_N
  Top 0.152: X1.2 5.22,19.83 5.84,20.45 6.56,20.45 D3.1.4
_P
  Top 0.152: X1.3 5.33,19.18 6.03,18.48 D3.1.6
CAN_RX
  Top 0.254: IC1.11 45.47,25.96 45.47,27.61 43.92,29.16 43.92,32.6 43.31,33.21 39.31,33.21 38.35,32.26 CAN.2
CAN_TX  (via drill 0.35)
  Top 0.254: IC1.12 44.22,25.93 v44.22,27.92
  Bottom 0.254: v44.22,27.92 39.89,27.92 38.35,29.46 CAN.3
DTR
  Bottom 0.152: T1.3.2 30.03,19.05 29.59,19.5 R1.11.1 26.48,19.94 IC3.18
ECHO_US0
  Top 0.152: US0.3 34.8,20.07 31.87,20.07 31.14,20.8 31.14,21.27 R1.2
ECHO_US1
  Top 0.152: US1.3 32.8,18.76 R2.1
GND  (via drill 0.35)  (1 unrouted)
  Top 0.254: X1.5 7.49,17.88 7.75,18.13 7.75,19.05 8.13,19.43 D3.1.2 | IC1.38 58.21,9.48 v57.91,9.78 | IC1.THERMAL1 IC1.T_VIA3 | IC1.THERMAL1 IC1.T_VIA4 | IC1.THERMAL1 IC1.T_VIA2 | IC1.THERMAL1 IC1.T_VIA1
  Bottom 0.152: IC3.13 IC3.EXP IC3.3 | 19.86,24.98 C3.6.1 20.4,25.44 20.45,25.49 | v22.1,16.89 22.1,16.47 C3.2.2 19.49,15.37 C3.3.2 17.17,14.93 C3.1.2 | C1.9.2 C1.8.2 | R1.4.2 22.73,30.16 U$2.GND2
  Bottom 0.254: v57.91,9.78 57.91,11.6 C1.4.- C1.3.- 53.72,12.36 53.72,14.48 51.73,16.46 IC1.T_VIA2 | 50.6,18.46 IC1.T_VIA1 | SERVO3.3 REMOTE.3 | C3.4.2 19.86,24.98 | 20.4,25.44 21.93,25.44 R3.2.1 24.72,25.49 25.17,25.04 27.71,25.04 v27.81,25.15 28.08,25.41 28.49,25.41 29,25.91 29,26.67 28.53,27.14 | IC3.3 v22.1,16.89 | 28.53,27.14 28.49,27.18 | I2C.4 57.91,3.3 56.39,1.78 49.53,1.78 UART.4 | 28.53,27.14 28.52,27.14 28.49,27.17 24.14,27.17 U$2.GND2 | C3.5.2 14.56,21.12 v15.37,21.12 | IC1.THERMAL1 52.11,20.07 C1.8.2 | R1.6.2 48.51,20.64 IC1.T_VIA3
  Bottom 0.508: SERVO0.3 20.07,9.53 C7.1 17.46,9.97 16.51,10.92 R6.5.1 | C8.1 v7.18,10.41 7.18,14.92 7.11,14.99 | U$4.GND v10.67,3.11 | U$3.GND C4.1 2.03,16.38 3.43,14.99 7.11,14.99 | R6.3.1 9.59,16.32 8.26,14.99 7.11,14.99 | C3.1 6.54,31.43 AKKU1.1
  pour Top: 0.13,0 0.13,36.83 59.82,36.83 59.82,0
GPI34
  Top 0.152: IC1.6 51.86,27.22 52.58,27.94 54.61,27.94 55.5,28.83 55.5,31.5 56.13,32.13 SHARP2.2
GPI35
  Top 0.152: IC1.7 50.59,27.86 51.44,28.7 51.44,31.62 51.94,32.13 SHARP3.2
GPI36/SENSOR_VP  (via drill 0.35)
  Top 0.152: v33.53,27.3 35.16,27.3 v35.18,27.29 | IC1.4 54.4,23.79 53.72,23.11 v52.71,23.11
  Bottom 0.152: v33.53,27.3 33.24,27.59 24.87,27.59 23.99,28.46 24,28.47 24,31.5 | v35.18,27.29 36.82,25.65 38.59,25.65 39.14,25.1 39.6,25.1 39.64,25.15 49.66,25.15 49.76,25.04 49.81,25.04 51.74,23.11 v52.71,23.11 | 24,31.5 24,33.8 23.51,34.29 R1.3.2 | R1.4.1 23.24,32.26 24,31.5
GPI39/SENSOR_VN  (via drill 0.35)
  Top 0.152: IC1.5 53.13,24.43 52.07,23.37 v48.9,23.37 | R1.5.2 v28.07,1.52 | v37.21,5.33 37.21,7.95 37.26,8 37.26,8.05 38.86,9.65 41.28,9.65 43.69,12.06 43.69,20.95 v44.2,21.46
  Bottom 0.152: v48.9,23.37 47.69,23.37 R1.6.1 v44.2,21.46 | v28.07,1.52 31.61,1.52 32.03,1.1 34.88,1.1 37.21,3.43 v37.21,5.33
GPIO0  (via drill 0.35)
  Top 0.152: v38.48,7.62 IC1.25
  Bottom 0.152: v38.48,7.62 36.93,9.17 36.93,9.81 36.07,10.67 25.78,10.67 25.27,11.18 U$2.STBY 26.42,14.48 29.04,14.48 T1.3.3
GPIO2  (via drill 0.35)
  Top 0.152: T1.2.3 27.56,18.46 T1.1.3 36.41,15.03 v37.72,13.72 | v37.72,11.18 37.86,11.03 IC1.24
  Bottom 0.152: v37.72,13.72 v37.72,11.18
GPIO12
  Top 0.254: IC1.14 41.7,27.22 43.33,28.85 43.33,30.33 WS2812.2
GPIO13
  Top 0.254: IC1.16 36.21,21.19 US0.2
GPIO14
  Top 0.254: IC1.13 42.97,24.43 42.04,23.5 38.18,23.5 37.39,22.71 34.39,22.71 US1.2
GPIO15
  Top 0.152: REMOTE.2 35.69,6.86 36.96,8.13 36.96,11.56 37.7,12.3 IC1.23
GPIO18  (via drill 0.35)
  Top 0.152: IC1.30 48.05,6.8 v47.24,5.99 | U$2.PWMA 18.41,12.57 18.41,8.51 18.88,8.04 v19.68,8.04
  Bottom 0.152: v47.24,5.99 38.21,5.99 36.16,8.04 v19.68,8.04
GPIO19  (via drill 0.35)
  Top 0.152: IC1.31 49.32,5.12 49.15,4.95 49.15,2.41 48.87,2.13 36.22,2.13 35.03,3.33 34.01,3.33 33.34,4 v33.34,5.97 | SERVO0.2 21.83,8.5 21.83,9.79 21.29,10.33 21.16,10.33 20.19,11.3 U$2.AI2
  Bottom 0.152: v33.34,5.97 32.83,5.46 21.59,5.46 SERVO0.2
GPIO21  (via drill 0.35)
  Top 0.152: IC1.33 51.86,5.12 51.56,4.83 51.56,1.91 51.49,1.83 34.69,1.83 v33.91,2.61 | v28.57,2.61 26.47,2.61 25.53,3.56 25.53,6.48 25.27,6.73 25.26,6.74 | U$2.AI1 22.73,12.32 25.26,9.79 25.26,8.89 25.26,8.75 25.26,6.74 | 25.26,6.74 25.15,6.86 SERVO1.2
  Bottom 0.152: v33.91,2.61 v28.57,2.61
GPIO22  (via drill 0.35)
  Top 0.152: IC1.36 55.88,7.4 55.88,5.46 56.36,4.98 56.36,2.01 55.88,1.52 34.08,1.52 v33.91,1.7 | v32.26,1.65 29.59,1.65 29.21,2.03 29.21,6.22 | 29.21,6.22 28.57,6.86 SERVO2.2 | 29.21,6.22 29.21,11.94 U$2.BI1
  Bottom 0.152: v33.91,1.7 32.31,1.7 v32.26,1.65
GPIO23
  Top 0.152: IC1.37 56.94,5 56.67,4.73 56.67,1.68 56.08,1.09 33.33,1.09 33.02,1.4 33.02,5.08 SERVO3.2 32.77,6.86 33.02,7.11 33.02,9.91 31.69,11.24 31.62,11.3 30.35,12.57 U$2.BI2
GPIO25  (via drill 0.35)
  Top 0.152: v42.55,14.28 42.55,21.59 44.07,23.11 46.23,23.11 46.78,23.66 IC1.10
  Bottom 0.152: U$2.PWMB 33.84,14.28 v42.55,14.28
GPIO32
  Top 0.152: IC1.8 49.32,27.22 51.05,28.96 51.05,31.75 50.55,32.26 SHARP1.2
GPIO33
  Top 0.152: IC1.9 48.05,27.9 47.5,28.45 47.5,31.62 46.99,32.13 SHARP0.2
MC_RX  (via drill 0.35)
  Top 0.152: v52.2,11.18 53.13,10.24 IC1.34
  Bottom 0.152: IC3.17 31,20.44 31.62,19.81 44.32,19.81 47.12,17.02 47.12,15.37 47.62,14.86 50.93,14.86 52.2,13.59 v52.2,11.18
MC_TX  (via drill 0.35)
  Top 0.152: v55.12,10.37 54.36,9.61 54.36,7.66 IC1.35
  Bottom 0.152: v55.12,10.37 54.26,10.37 54.12,10.52 51.71,10.52 51.31,10.92 51.31,13.59 50.42,14.48 47.5,14.48 46.36,15.62 45.47,15.62 44.68,14.83 32.02,14.83 31.24,15.62 23.86,15.62 23.1,16.38 IC3.1
MOTOR_A_OUT_0
  Top 1.524: MOTOR_A.1 U$2.A01
MOTOR_A_OUT_1
  Top 1.524: MOTOR_A.2 U$2.A02
MOTOR_B_OUT_0
  Top 1.524: MOTOR_B.2 33.02,28.7 U$2.B01
MOTOR_B_OUT_1
  Top 1.524: U$2.B02 30.35,32.51 MOTOR_B.1
N$1  (via drill 0.35)
  Top 0.508: D1.2 v10.16,33.53
  Bottom 0.508: L1.2 4.57,34.92 5.21,35.56 8,35.56 8.44,35.12 C3.2 9.59,33.02 | 9.59,33.02 R6.1.2 R6.2.2 C2.2 | v10.16,33.53 9.65,33.02 9.59,33.02
N$2
  Top 0.152: R1.1 28.57,22.05 T1.2.1
N$3
  Top 0.152: T1.1.1 28.68,17.06 R2.2
N$4
  Bottom 0.508: U$3.BOOT 7.17,17.39 C1.1
N$5
  Bottom 0.508: L1.1 5.21,22.85 5.21,19.94 4.76,19.49 | U$3.SW 4.44,19.18 4.76,19.49 | 4.76,19.49 5.27,18.98 C1.2
N$7
  Bottom 0.508: C2.1 11.49,20.24 10.92,19.67 8.77,19.67 8.32,20.13 U$3.FB | C2.1 R6.3.2 | C2.1 R6.2.1
N$8
  Bottom 0.508: U$4.BOOT 14.34,1.32 C5.1
N$9
  Bottom 0.152: R1.12.2 28.09,16.76 T1.3.1
N$10
  Bottom 0.152: R1.11.2 27.3,21.78 27.3,22.99 27.69,23.37 29.31,23.37 T1.4.1
N$11  (via drill 0.35)
  Top 0.508: v11.49,27.43 11.49,27.46 LED1.A
  Bottom 0.508: R6.1.1 v11.49,27.43
N$12
  Bottom 0.152: R3.5.1 26.04,23.24 25.55,22.75 22.75,22.75 22.6,22.61 IC3.14
N$13
  Bottom 0.152: IC3.7 19.43,19.44 18.92,18.93 18.92,18.16 18.47,17.7 16.88,17.7 16.13,16.95 R3.6.1
N$14
  Bottom 0.508: C5.2 12.85,1.74 12.85,3.58 12.37,4.06 U$4.SW 8.52,4.06 L2.1
N$15
  Bottom 0.508: R6.5.2 C6.1 12,8.26 R6.4.1 12,6.66 13.65,5.01 U$4.FB
N$16
  Bottom 0.152: R3.5.2 26.36,26.29 LED3.C
N$17
  Bottom 0.152: R3.6.2 13.84,13.5 LED4.C
N$18
  Bottom 0.152: R3.4.2 19.01,19.94 IC3.8
N$19
  Bottom 0.152: R3.3.2 18.89,20.44 IC3.9
N$20  (via drill 0.35)
  Top 0.152: L3.1.3 v15.37,18.93
  Bottom 0.152: v15.37,18.93 15.43,18.99 15.49,19.05 R3.4.1
  Bottom 0.254: C3.5.1 14.12,18.99 15.43,18.99
N$21  (via drill 0.35)
  Top 0.152: L3.1.2 14.31,20.32 v15.37,20.32
  Bottom 0.152: v15.37,20.32 16.26,21.21 R3.3.1 16.55,21.34 C3.4.1
N$22
  Bottom 0.152: R3.1.1 22.86,24.68 R3.2.2 21.54,23.36 21.1,22.92 IC3.11
N$23
  Top 0.152: D3.1.1 10.77,18.48 L3.1.4
N$24
  Top 0.152: D3.1.3 10.77,20.38 L3.1.1
N$25
  Top 0.254: L3.3.1 L3.2.2 7.96,22.35 C3.7.1
N$26
  Top 0.254: 5.85,20.96 5.37,20.48 X1.1 | 5.85,20.96 7.29,20.96 7.45,20.8 7.45,19.81 7.07,19.43 D3.1.5 | L3.2.1 6.01,21.11 5.85,20.96
N$27  (via drill 0.35)
  Top 0.508: v5.01,10.54 4.99,10.57 LED2.A
  Bottom 0.508: R6.6.1 v5.01,10.54
N$30
  Top 0.254: L3.3.2 6.01,24.97 F3.1.2
RESET  (via drill 0.35)
  Top 0.152: v25.4,34.92 24.87,34.39 24.86,34.39 24.76,34.29 SW2.1 | v53.72,21.46 55.25,21.46 55.67,21.89 IC1.3
  Bottom 0.152: v25.4,34.92 33.78,34.92 34.42,34.29 34.42,25.25 33.91,24.74 | 33.91,24.74 31.72,24.74 31.32,24.34 T1.4.3 | R1.13.2 52.32,21.46 | 52.32,21.46 v53.72,21.46 | 33.91,24.74 49.68,24.74 52.32,22.1 52.32,21.46
RTS  (via drill 0.35)
  Top 0.152: v29.46,21.07 29.46,19.43 v28.7,18.67
  Bottom 0.152: IC3.19 25.65,19.43 25.95,19.14 25.95,18.75 26.08,18.62 27.05,18.62 | v28.7,18.67 28.65,18.62 27.05,18.62 | R1.12.1 25.56,17.74 26.17,17.74 27.05,18.62 | T1.4.2 28.64,21.9 v29.46,21.07
SCL33  (via drill 0.35)
  Top 0.254: v46.8,10.16 46.8,7.64 IC1.29
  Bottom 0.254: R1.2.2 v46.8,10.16 53.98,10.16 55.37,8.76 I2C.3
SDA33  (via drill 0.35)
  Top 0.254: v42.74,9.91 42.97,9.68 IC1.26
  Bottom 0.254: R1.1.2 v42.74,9.91 43.37,9.27 52.07,9.27 52.83,8.51 I2C.2
SERVO
  Bottom 1.524: SERVO3.1 SERVO2.1 SERVO1.1 SERVO0.1 SERVO.2
U2RXD
  Top 0.152: IC1.27 44.2,7.57 44.2,5.59 UART.2
U2TXD
  Top 0.152: UART.3 45.51,4.36 IC1.28
VUSB  (via drill 0.35)
  Top 0.254: F3.1.1 10.67,24.56 v14.81,24.56
  Bottom 0.254: R3.1.2 23.96,26.33 23.37,26.92 D2.2 20.5,26.6 19.81,25.91 19.26,25.91 17.91,24.56 v14.81,24.56
WS2812  (via drill 0.35)
  Top 0.254: v17.53,25.78 27.52,25.78 27.54,25.8 29.77,25.8 v30.62,24.95 | v31.95,26.38 32.31,26.38 32.37,26.44 36.61,26.44 37.03,26.01 39.01,26.01 v39.37,25.65
  Bottom 0.254: WS2812.1 43.82,32.38 43.82,29.26 44.88,28.2 44.88,27.61 43.05,25.78 39.5,25.78 v39.37,25.65 | WS2812_JUMPER.2 v17.53,25.78 | v30.62,24.95 32,26.33 v31.95,26.38